# EAGLE design eib-64-nanoz-adapter (EAGLE 9.5.2)
DESIGNER: JPN@MIT; DESIGN_NAME: EIB-64 NanoZ Adapter; LICENSE: CERN OHL v1.2; REVISION: 1.1
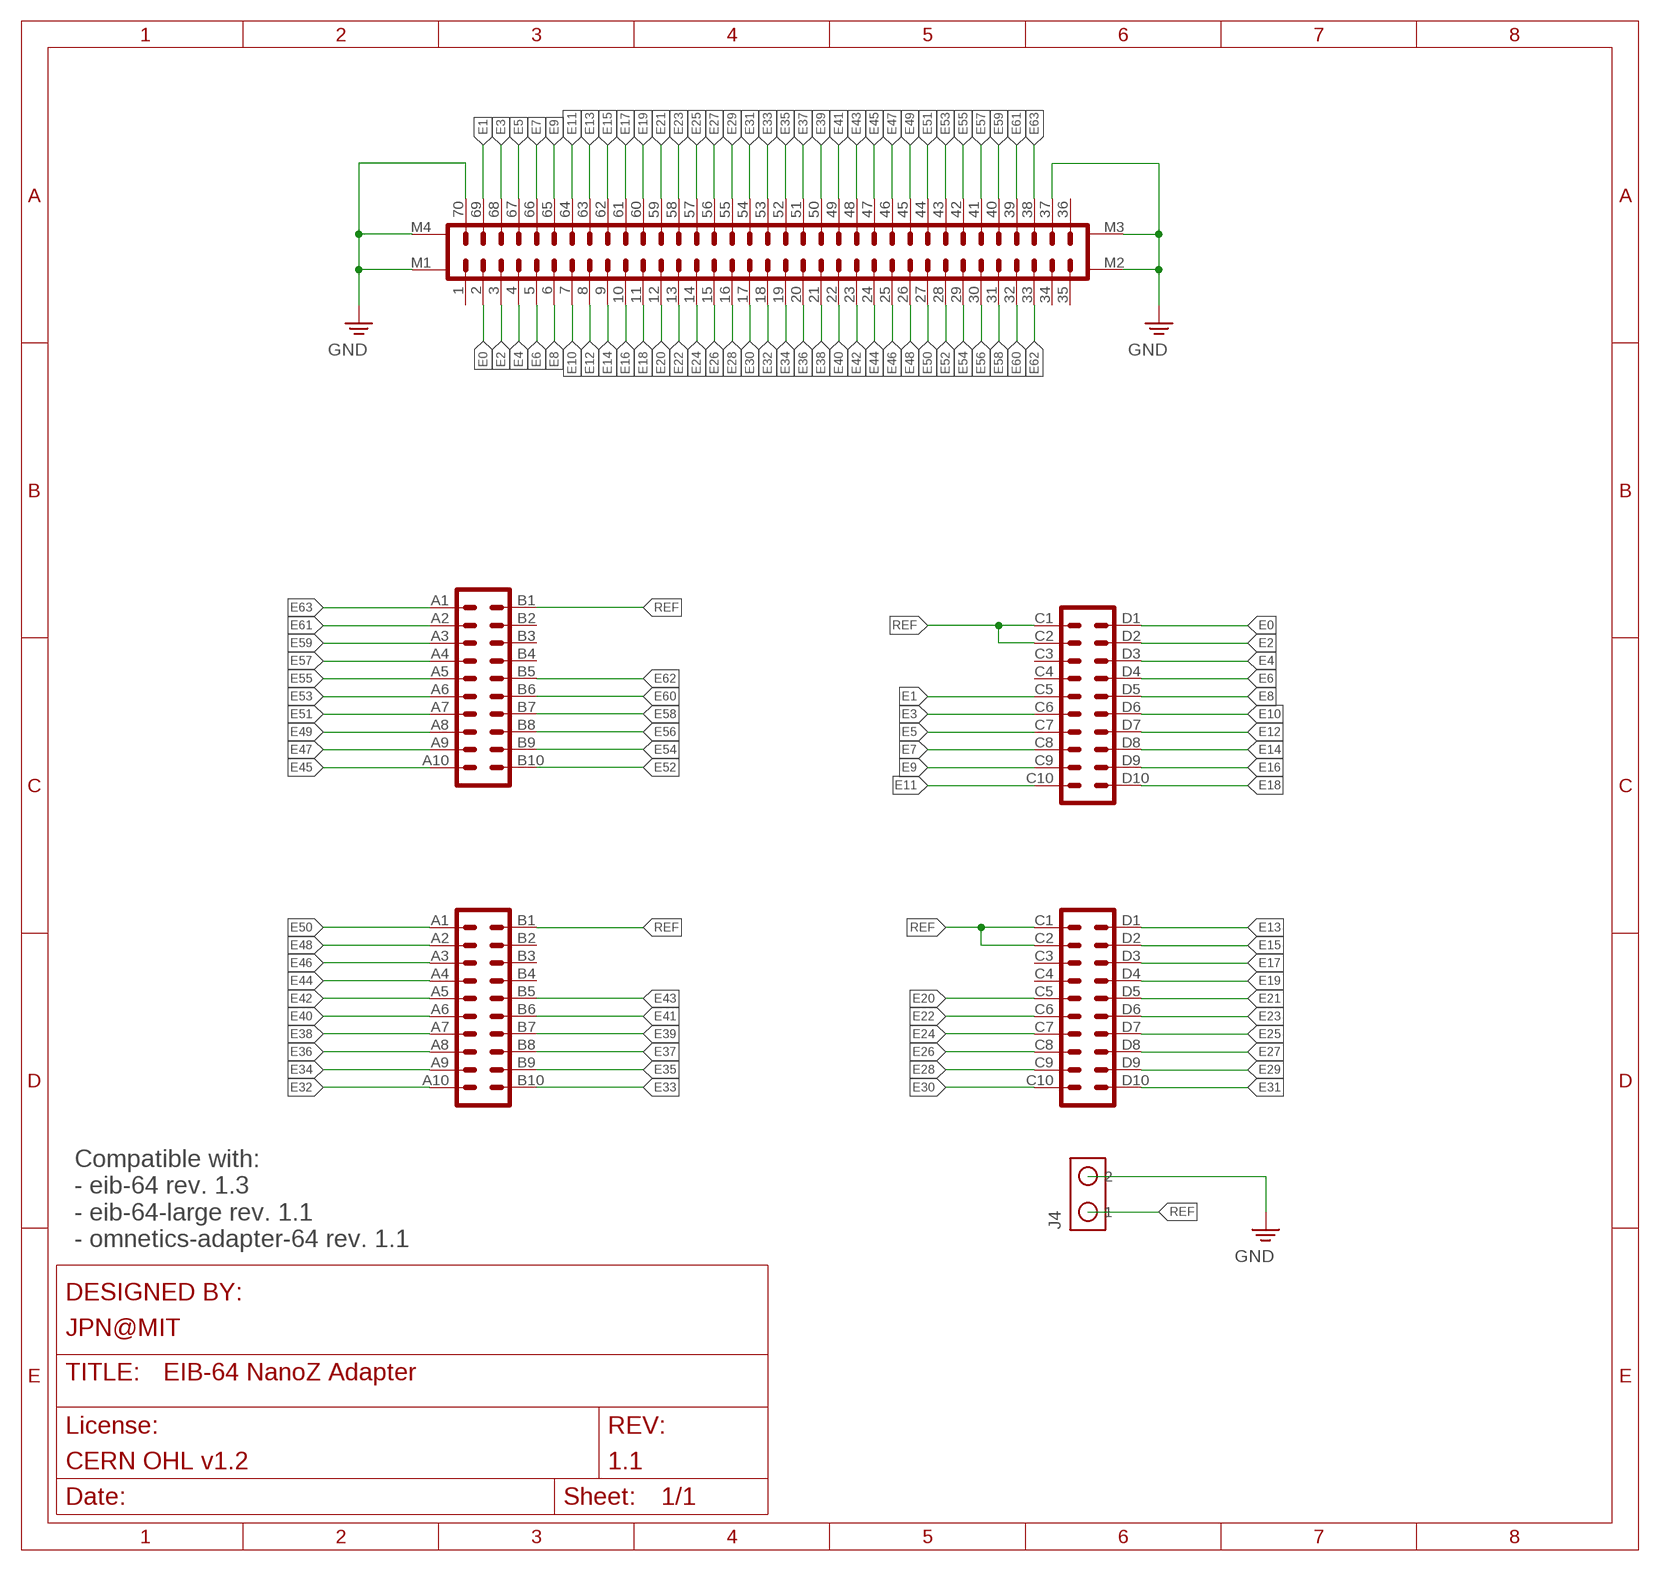
[diagram p0: schematic, sheet 1]

## Parts
J1  DF40-REC  PINHD-2X35+4_DF40-70HEAD  [DF40-70HEAD]
J2  PINHD-4X10_MOLC-THRU  [MOLC-110-11-S-Q]
J3  PINHD-4X10_MOLC-THRU  [MOLC-110-11-S-Q]
J4  SCREW2  [SCREW2]

## Nets
E0: J1.2 J2.D1
E1: J1.69 J2.C5
E2: J1.3 J2.D2
E3: J1.68 J2.C6
E4: J1.4 J2.D3
E5: J1.67 J2.C7
E6: J1.5 J2.D4
E7: J1.66 J2.C8
E8: J1.6 J2.D5
E9: J1.65 J2.C9
E10: J1.7 J2.D6
E11: J1.64 J2.C10
E12: J1.8 J2.D7
E13: J1.63 J3.D1
E14: J1.9 J2.D8
E15: J1.62 J3.D2
E16: J1.10 J2.D9
E17: J1.61 J3.D3
E18: J1.11 J2.D10
E19: J1.60 J3.D4
E20: J1.12 J3.C5
E21: J1.59 J3.D5
E22: J1.13 J3.C6
E23: J1.58 J3.D6
E24: J1.14 J3.C7
E25: J1.57 J3.D7
E26: J1.15 J3.C8
E27: J1.56 J3.D8
E28: J1.16 J3.C9
E29: J1.55 J3.D9
E30: J1.17 J3.C10
E31: J1.54 J3.D10
E32: J1.18 J3.A10
E33: J1.53 J3.B10
E34: J1.19 J3.A9
E35: J1.52 J3.B9
E36: J1.20 J3.A8
E37: J1.51 J3.B8
E38: J1.21 J3.A7
E39: J1.50 J3.B7
E40: J1.22 J3.A6
E41: J1.49 J3.B6
E42: J1.23 J3.A5
E43: J1.48 J3.B5
E44: J1.24 J3.A4
E45: J1.47 J2.A10
E46: J1.25 J3.A3
E47: J1.46 J2.A9
E48: J1.26 J3.A2
E49: J1.45 J2.A8
E50: J1.27 J3.A1
E51: J1.44 J2.A7
E52: J1.28 J2.B10
E53: J1.43 J2.A6
E54: J1.29 J2.B9
E55: J1.42 J2.A5
E56: J1.30 J2.B8
E57: J1.41 J2.A4
E58: J1.31 J2.B7
E59: J1.40 J2.A3
E60: J1.32 J2.B6
E61: J1.39 J2.A2
E62: J1.33 J2.B5
E63: J1.38 J2.A1
GND: J1.37 J1.70 J1.M1 J1.M2 J1.M3 J1.M4 J4.P$2
REF: J2.B1 J2.C1 J2.C2 J3.B1 J3.C1 J3.C2 J4.P$1
Unconnected: J1.1 J1.34 J1.35 J1.36 J2.B2 J2.B3 J2.B4 J2.C3 J2.C4 J3.B2 J3.B3 J3.B4 J3.C3 J3.C4

## Notes on the sheet
- Compatible with:
  - eib-64 rev. 1.3
  - eib-64-large rev. 1.1
  - omnetics-adapter-64 rev. 1.1

## Library data of the parts
J1 = jonnew:PINHD-2X35+4
J2 J3 = jonnew:PINHD-4X10
J4 = jonnew:SCREW2: Screw Terminal

## Net classes
1 thick: width 0.102 mm

## Board
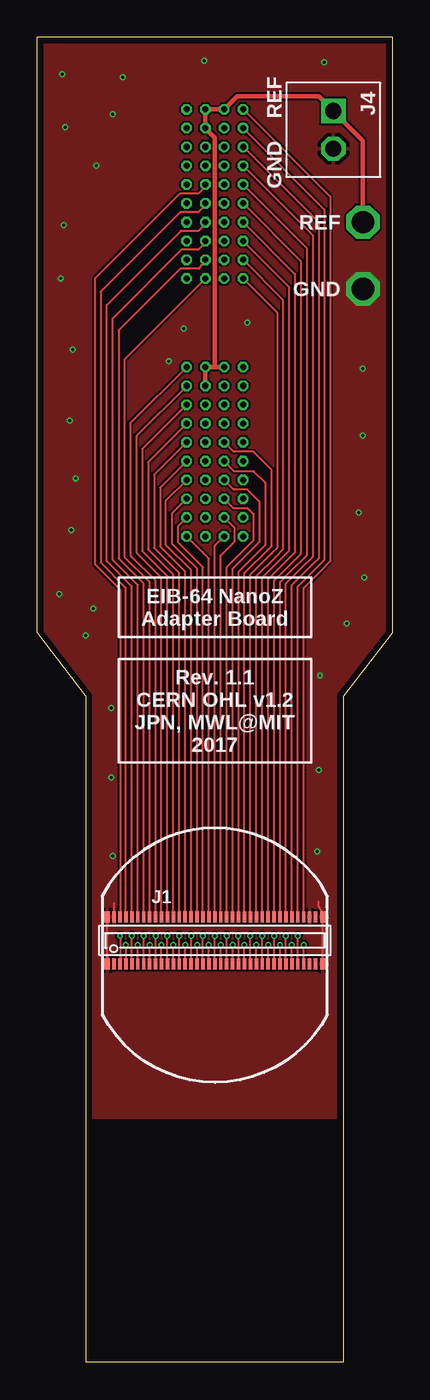
[diagram p1: board, top side]
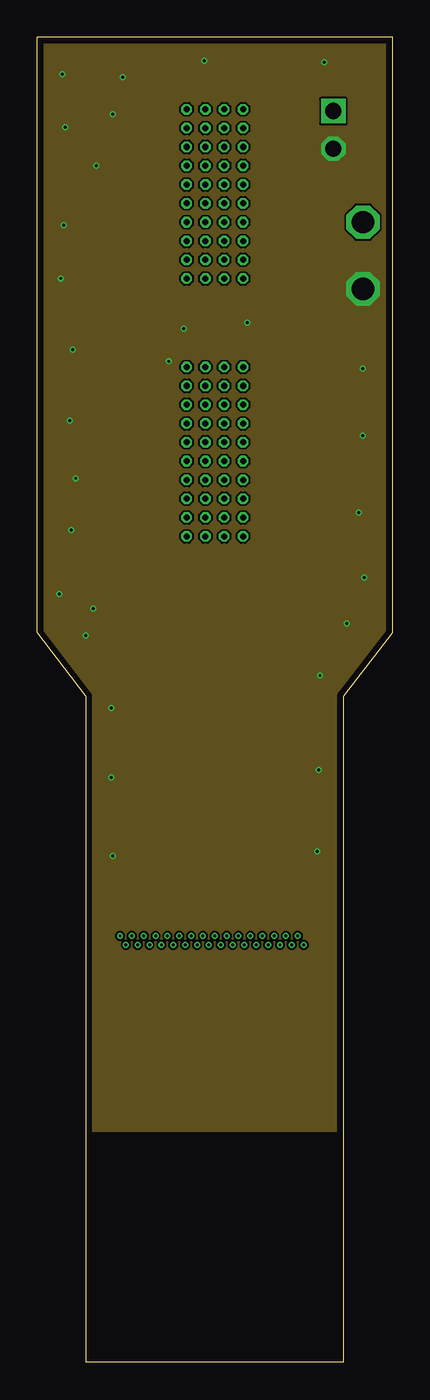
[diagram p2: board, inner layer Route2]
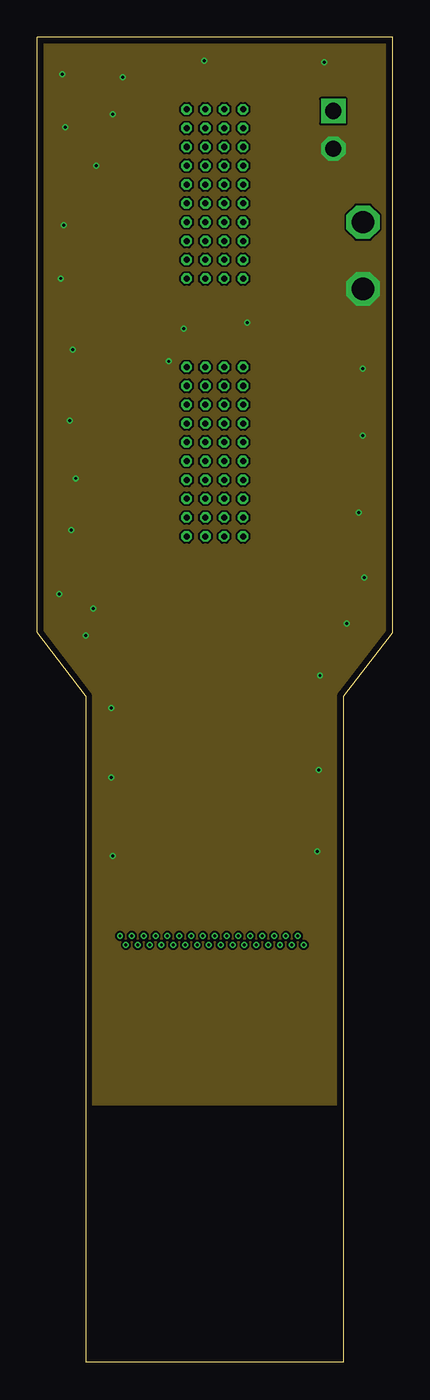
[diagram p3: board, inner layer Route15]
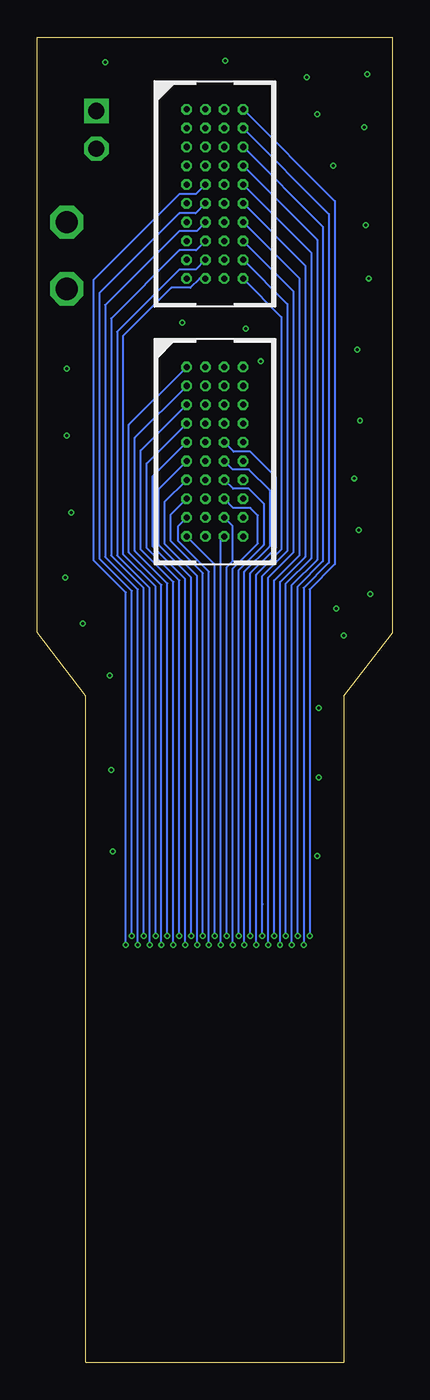
[diagram p4: board, bottom side, seen from below]

Size 24 x 89.5 mm. Coordinates in mm from the lower left corner, seen from the top.
Outline: 20.7,0 20.7,45 24,49.3 24,89.5 0,89.5 0,49.3 3.3,45 3.3,0 20.7,0
Copper layers (1*2*15*16): Top 0.035mm / dielectric 0.2mm / Route2 0.0175mm / dielectric 0.3mm / Route15 0.0175mm / dielectric 0.2mm / Bottom 0.035mm
Design rules "seeed-studio-4-layer *": minimum track width 5mil, minimum drill 0.2mm, track to track 5mil, track to pad 5mil, pad to pad 5mil, via to via 5mil, smd to smd 0mil, copper to edge 0.4mm, drill to drill 10mil, minimum pad ring 6mil, minimum via ring 4mil, stop-mask expansion 4mil, vias tented up to drill 100mil, thermal gap 10mil

### Footprints (pad centres in the part's own frame; a part is rotated, then mirrored left to right if it is on the bottom)
DF40-70HEAD = smd 0.23 x 0.75: 1 -6.8,-1.585; 2 -6.4,-1.585; 3 -6,-1.585; 4 -5.6,-1.585; 5 -5.2,-1.585; 6 -4.8,-1.585; 7 -4.4,-1.585; 8 -4,-1.585; 9 -3.6,-1.585; 10 -3.2,-1.585; 11 -2.8,-1.585; 12 -2.4,-1.585; 13 -2,-1.585; 14 -1.6,-1.585; 15 -1.2,-1.585; 16 -0.8,-1.585; 17 -0.4,-1.585; 18 0,-1.585; 19 0.4,-1.585; 20 0.8,-1.585; 21 1.2,-1.585; 22 1.6,-1.585; 23 2,-1.585; 24 2.4,-1.585; 25 2.8,-1.585; 26 3.2,-1.585; 27 3.6,-1.585; 28 4,-1.585; 29 4.4,-1.585; 30 4.8,-1.585; 31 5.2,-1.585; 32 5.6,-1.585; 33 6,-1.585; 34 6.4,-1.585; 35 6.8,-1.585; 36 6.8,1.585; 37 6.4,1.585; 38 6,1.585; 39 5.6,1.585; 40 5.2,1.585; 41 4.8,1.585; 42 4.4,1.585; 43 4,1.585; 44 3.6,1.585; 45 3.2,1.585; 46 2.8,1.585; 47 2.4,1.585; 48 2,1.585; 49 1.6,1.585; 50 1.2,1.585; 51 0.8,1.585; 52 0.4,1.585; 53 0,1.585; 54 -0.4,1.585; 55 -0.8,1.585; 56 -1.2,1.585; 57 -1.6,1.585; 58 -2,1.585; 59 -2.4,1.585; 60 -2.8,1.585; 61 -3.2,1.585; 62 -3.6,1.585; 63 -4,1.585; 64 -4.4,1.585; 65 -4.8,1.585; 66 -5.2,1.585; 67 -5.6,1.585; 68 -6,1.585; 69 -6.4,1.585; 70 -6.8,1.585 | smd 0.35 x 0.75: M1 -7.275,-1.585; M2 7.275,-1.585; M3 7.275,1.585; M4 -7.275,1.585
MOLC-110-11-S-Q = drill 0.406 octagon: A1 -1.905,5.715; A2 -1.905,4.445; A3 -1.905,3.175; A4 -1.905,1.905; A5 -1.905,0.635; A6 -1.905,-0.635; A7 -1.905,-1.905; A8 -1.905,-3.175; A9 -1.905,-4.445; A10 -1.905,-5.715; B1 -0.635,5.715; B2 -0.635,4.445; B3 -0.635,3.175; B4 -0.635,1.905; B5 -0.635,0.635; B6 -0.635,-0.635; B7 -0.635,-1.905; B8 -0.635,-3.175; B9 -0.635,-4.445; B10 -0.635,-5.715; C1 0.635,5.715; C2 0.635,4.445; C3 0.635,3.175; C4 0.635,1.905; C5 0.635,0.635; C6 0.635,-0.635; C7 0.635,-1.905; C8 0.635,-3.175; C9 0.635,-4.445; C10 0.635,-5.715; D1 1.905,5.715; D2 1.905,4.445; D3 1.905,3.175; D4 1.905,1.905; D5 1.905,0.635; D6 1.905,-0.635; D7 1.905,-1.905; D8 1.905,-3.175; D9 1.905,-4.445; D10 1.905,-5.715
SCREW2 = drill 1.1 square: P$1 0,0 | drill 1.1 octagon: P$2 2.54,0

### Placement (x,y rotation side)
J1  12,28.5 0 top
J2  12,78.9 0 bottom
J3  12,61.5 0 bottom
J4  20,84.5 270 top

### Tracks (layer width: path | path; a pad name or v marks a point on that pad's centre or on a via)
E0  (via drill 0.2)
  Top 0.127: v5.6,28.8 J1.2
  Bottom 0.127: J2.D1 3.9,78.42 3.9,53.9 5.6,52.2 v5.6,28.8
E1
  Top 0.127: J2.C5 11.49,79.54 10.89,78.94 9.64,78.94 3.9,73.2 3.9,53.9 5.6,52.2 J1.69
E2  (via drill 0.2)
  Top 0.127: v6,28.2 J1.3
  Bottom 0.127: J2.D2 4.3,77.55 4.3,54 6,52.3 v6,28.2
E3
  Top 0.127: J2.C6 11.49,78.27 10.89,77.67 9.67,77.67 4.3,72.3 4.3,54 6,52.3 J1.68
E4  (via drill 0.2)
  Top 0.127: J1.4 v6.4,28.8
  Bottom 0.127: J2.D3 4.7,76.68 4.7,54.1 6.4,52.4 v6.4,28.8
E5
  Top 0.127: J2.C7 11.49,77 10.89,76.4 9.7,76.4 4.7,71.4 4.7,54.1 | 4.7,54.1 6.4,52.4 | J1.67 6.4,52.4 | 6.4,52.4 4.7,54.1
E6  (via drill 0.2)
  Top 0.127: J1.5 v6.8,28.2
  Bottom 0.127: J2.D4 5.1,75.81 5.1,54.2 6.8,52.5 v6.8,28.2
E7
  Top 0.127: J2.C8 11.49,75.73 10.89,75.13 9.73,75.13 5.1,70.5 5.1,54.2 | 5.1,54.2 6.8,52.5 | J1.66 6.8,52.5 | 6.8,52.5 5.1,54.2
E8  (via drill 0.2)
  Top 0.127: J1.6 v7.2,28.8
  Bottom 0.127: J2.D5 5.5,74.94 5.5,54.3 7.2,52.6 v7.2,28.8
E9
  Top 0.127: J2.C9 10.93,73.86 9.66,73.86 5.5,69.7 5.5,54.3 7.2,52.6 J1.65
E10  (via drill 0.2)
  Top 0.127: J1.7 v7.6,28.2
  Bottom 0.127: J2.D6 5.9,74.07 5.9,54.4 7.6,52.7 v7.6,28.2
E11
  Top 0.127: J2.C10 5.9,67.72 5.9,54.4 7.6,52.7 J1.64
E12  (via drill 0.2)
  Top 0.127: J1.8 v8,28.8
  Bottom 0.127: J2.D7 6.3,73.2 6.3,54.5 8,52.8 v8,28.8
E13
  Top 0.127: J3.D1 6.3,63.42 6.3,54.5 8,52.8 J1.63
E14  (via drill 0.2)
  Top 0.127: J1.9 v8.4,28.2
  Bottom 0.127: J2.D8 6.7,72.33 6.7,54.7 8.4,53 v8.4,28.2
E15
  Top 0.127: J3.D2 6.7,62.55 6.7,54.7 8.4,53 J1.62
E16  (via drill 0.2)
  Top 0.127: J1.10 v8.8,28.8
  Bottom 0.127: 8.8,31 8.8,53.1 7.1,54.8 7.1,71.46 J2.D9 | 8.8,31 8.8,30.9 | v8.8,28.8 8.8,31
E17
  Top 0.127: J3.D3 7.1,61.68 7.1,54.8 7.7,54.2 | 7.7,54.2 8.8,53.1 | J1.61 8.8,53.1 | 8.8,53.1 7.7,54.2
E18  (via drill 0.2)
  Top 0.127: J1.11 v9.2,28.2
  Bottom 0.127: J2.D10 7.5,70.59 7.5,54.9 9.2,53.2 v9.2,28.2
E19
  Top 0.127: J3.D4 7.5,60.81 7.5,54.9 7.95,54.45 | 7.95,54.45 9.2,53.2 | J1.60 9.2,53.2 | 9.2,53.2 7.95,54.45
E20  (via drill 0.2)
  Top 0.127: J1.12 v9.6,28.8
  Bottom 0.127: J3.C5 10.73,61.5 9.6,61.5 7.9,59.8 7.9,55 9.6,53.3 v9.6,28.8
E21
  Top 0.127: J3.D5 7.9,59.94 7.9,55 8.2,54.7 | 8.2,54.7 9.6,53.3 | J1.59 9.6,53.3 | 9.6,53.3 8.2,54.7
E22  (via drill 0.2)
  Top 0.127: J1.13 v10,28.2
  Bottom 0.127: J3.C6 10.8,60.3 9.7,60.3 8.3,58.9 8.3,55.1 10,53.4 v10,28.2
E23
  Top 0.127: J3.D6 8.3,59.07 8.3,55.1 8.95,54.45 | 8.95,54.45 10,53.4 | J1.58 10,53.4 | 10,53.4 8.95,54.45
E24  (via drill 0.2)
  Top 0.127: J1.14 v10.4,28.8
  Bottom 0.127: J3.C7 10.77,59 9.7,59 8.7,58 8.7,55.2 10.4,53.5 v10.4,28.8
E25
  Top 0.127: J3.D7 8.7,58.2 8.7,55.2 | 8.7,55.2 10.4,53.5 | J1.57 10.4,53.5 | 10.4,53.5 8.7,55.2
E26  (via drill 0.2)
  Top 0.127: J1.15 v10.8,28.2
  Bottom 0.127: J3.C8 10.74,57.7 9.6,57.7 9.1,57.2 9.1,55.3 10.8,53.6 v10.8,28.2
E27
  Top 0.127: J3.D8 9.1,57.33 9.1,55.3 9.95,54.45 | 9.95,54.45 10.8,53.6 | J1.56 10.8,53.6 | 10.8,53.6 9.95,54.45
E28  (via drill 0.2)
  Top 0.127: J1.16 v11.2,28.8
  Bottom 0.127: J3.C9 10.8,56.49 10.8,54.1 11.2,53.7 v11.2,28.8
E29
  Top 0.127: J3.D9 9.5,56.46 9.5,55.4 10.2,54.7 | 10.2,54.7 11.2,53.7 | J1.55 11.2,53.7 | 11.2,53.7 10.2,54.7
E30  (via drill 0.2)
  Top 0.127: J1.17 v11.6,28.2
  Bottom 0.127: J3.C10 11.6,55.55 v11.6,28.2
E31
  Top 0.127: 11.19,54.69 J3.D10 | 11.19,54.69 11.6,54.28 | J1.54 11.6,54.28 | 11.6,54.28 11.19,54.69
E32  (via drill 0.2)
  Top 0.127: J1.18 v12,28.8
  Bottom 0.127: J3.A10 12,53.88 v12,28.8
E33
  Top 0.127: 12,55.15 J3.B10 12,55.15 | J1.53 12,55.15
E34  (via drill 0.2)
  Top 0.127: J1.19 v12.4,28.2
  Bottom 0.127: J3.A9 14.5,56.46 14.5,55.5 12.4,53.4 v12.4,28.2
E35
  Top 0.127: J3.B9 13.3,56.39 13.3,55.4 13.2,55.3 | 13.2,55.3 12.4,54.5 | J1.52 12.4,54.5 | 12.4,54.5 13.2,55.3
E36  (via drill 0.2)
  Top 0.127: J1.20 v12.8,28.8
  Bottom 0.127: J3.A8 15,57.23 15,55.5 12.8,53.3 v12.8,28.8
E37
  Top 0.127: J3.B8 13.26,57.7 14.2,57.7 14.6,57.3 14.6,55.5 13.8,54.7 | 13.8,54.7 12.8,53.7 | J1.51 12.8,53.7 | 12.8,53.7 13.8,54.7
E38  (via drill 0.2)
  Top 0.127: J1.21 v13.2,28.2
  Bottom 0.127: J3.A7 15.4,58.1 15.4,55.3 13.2,53.1 v13.2,28.2
E39
  Top 0.127: J3.B7 13.29,58.94 14.2,58.94 15,58.13 15,55.4 14.55,54.95 | 14.55,54.95 13.2,53.6 | J1.50 13.2,53.6 | 13.2,53.6 14.55,54.95
E40  (via drill 0.2)
  Top 0.127: J1.22 v13.6,28.79 v13.59,28.8
  Bottom 0.127: J3.A6 15.8,58.97 15.8,55.2 13.6,53 13.6,30.9 13.59,30.89 v13.59,28.8
E41
  Top 0.127: J3.B6 13.29,60.2 13.3,60.2 14.6,60.2 15.4,59.4 15.4,55.2 14.85,54.65 | 14.85,54.65 13.6,53.4 | J1.49 13.6,53.4 | 13.6,53.4 14.85,54.65
E42  (via drill 0.2)
  Top 0.127: J1.23 v14,28.2
  Bottom 0.127: J3.A5 16.2,59.84 16.2,55.1 14,52.9 v14,28.2
E43
  Top 0.127: J3.B5 | J3.B5 13.27,61.5 14.6,61.5 15.8,60.3 15.8,55.1 15.6,54.9 | 15.6,54.9 14,53.3 | J1.48 14,53.3 | 14,53.3 15.6,54.9
E44  (via drill 0.2)
  Top 0.127: J1.24 v14.4,28.8
  Bottom 0.127: J3.A4 16.6,60.71 16.6,55 14.4,52.8 v14.4,28.8
E45
  Top 0.127: J2.A10 16.2,70.89 16.2,55 15.85,54.65 | 15.85,54.65 14.4,53.2 | J1.47 14.4,53.2 | 14.4,53.2 15.85,54.65
E46  (via drill 0.2)
  Top 0.127: J1.25 v14.8,28.2
  Bottom 0.127: J3.A3 17,61.58 17,54.9 14.8,52.7 v14.8,28.2
E47
  Top 0.127: J2.A9 16.6,71.76 16.6,54.9 16.1,54.4 | 16.1,54.4 14.8,53.1 | J1.46 14.8,53.1 | 14.8,53.1 16.1,54.4
E48  (via drill 0.2)
  Top 0.127: J1.26 v15.2,28.8
  Bottom 0.127: J3.A2 17.4,62.45 17.4,54.8 15.2,52.6 v15.2,28.8
E49
  Top 0.127: J2.A8 17,72.63 17,54.8 16.35,54.15 | 16.35,54.15 15.2,53 | J1.45 15.2,53 | 15.2,53 16.35,54.15
E50  (via drill 0.2)
  Top 0.127: J1.27 v15.6,28.2
  Bottom 0.127: J3.A1 17.8,63.32 17.8,54.7 15.6,52.5 v15.6,28.2
E51
  Top 0.127: J2.A7 17.4,73.5 17.4,54.7 17.1,54.4 | 17.1,54.4 15.6,52.9 | J1.44 15.6,52.9 | 15.6,52.9 17.1,54.4
E52  (via drill 0.2)
  Top 0.127: J1.28 v16,28.8
  Bottom 0.127: J2.B10 13.03,73.19 13.65,72.57 14.93,72.57 18.2,69.3 18.2,54.6 16,52.4 v16,28.8
E53
  Top 0.127: J2.A6 17.8,74.37 17.8,54.6 17.35,54.15 | 17.35,54.15 16,52.8 | J1.43 16,52.8 | 16,52.8 17.35,54.15
E54  (via drill 0.2)
  Top 0.127: J1.29 v16.4,28.2
  Bottom 0.127: J2.B9 13.3,73.8 14.4,73.8 18.6,69.6 18.6,54.5 16.4,52.3 v16.4,28.2
E55
  Top 0.127: J2.A5 18.2,75.24 18.2,54.5 17.1,53.4 | 17.1,53.4 16.4,52.7 | J1.42 16.4,52.7 | 16.4,52.7 17.1,53.4
E56  (via drill 0.2)
  Top 0.127: J1.30 v16.8,28.8
  Bottom 0.127: J2.B8 13.26,75.1 14.4,75.1 19,70.5 19,54.5 16.8,52.3 v16.8,28.8
E57
  Top 0.127: J2.A4 18.6,76.11 18.6,54.4 17.85,53.65 | 17.85,53.65 16.8,52.6 | J1.41 16.8,52.6 | 16.8,52.6 17.85,53.65
E58  (via drill 0.2)
  Top 0.127: J1.31 v17.2,28.2
  Bottom 0.127: J2.B7 13.23,76.4 14.4,76.4 19.4,71.4 19.4,54.4 17.2,52.2 v17.2,28.2
E59
  Top 0.127: J2.A3 19,76.98 19,54.3 18.6,53.9 | 18.6,53.9 17.2,52.5 | J1.40 17.2,52.5 | 17.2,52.5 18.6,53.9
E60  (via drill 0.2)
  Top 0.127: J1.32 v17.6,28.8
  Bottom 0.127: J2.B6 13.3,77.6 14.4,77.6 19.8,72.2 19.8,54.3 17.6,52.1 v17.6,28.8
E61
  Top 0.127: J2.A2 19.4,77.85 19.4,54.2 18.85,53.65 | 18.85,53.65 17.6,52.4 | J1.39 17.6,52.4 | 17.6,52.4 18.85,53.65
E62  (via drill 0.2)
  Top 0.127: J1.33 v18,28.2
  Bottom 0.127: J2.B5 13.27,78.9 14.4,78.9 20.2,73.1 20.2,54.2 18,52 v18,28.2
E63
  Top 0.127: J2.A1 19.8,78.72 19.8,54.1 19.1,53.4 | 19.1,53.4 18,52.3 | J1.38 18,52.3 | 18,52.3 19.1,53.4
GND  (via drill 0.2, 1.5)
  Top 0.127: J1.M1 J1.M4 | J1.M2 J1.M3 19.27,30.32 19,30.8 19,31.1 | J1.70 5.2,31
  other vias: 22,72.5 20.9,49.9 22.1,53 21.7,57.4 22,62.6 22,67.1 2.2,63.6 2.3,56.2 3.3,49.1 3.8,50.9 1.6,73.2 4,80.8 1.7,87 11.3,87.9 5.8,86.8 19.4,87.8 14.2,70.2 9.9,69.8 8.9,67.6 1.5,51.9 2.6,59.7 2.4,68.4 1.8,76.8 1.9,83.4 5.1,84.3 5.1,34.2 18.9,34.5 19,40 19.1,46.4 5,44.2 5,39.5
  pour Top (rank 3): -4,93.5 26,93.5 26,16.5 -4,16.5
  pour Route2 (rank 3, no thermals): -2.7,92.6 27.3,92.6 27.3,15.6 -2.7,15.6
  pour Route15 (rank 3, no thermals): -5.4,94.4 24.6,94.4 24.6,17.4 -5.4,17.4
REF  (via drill 1.5)
  Top 0.305: 12,67.22 12,82.71 J2.C2 J2.C1 J2.B1 13.52,85.5 19,85.5 J4.P$1 22,82.5 v22,77 | J3.B1 12,67.22 | 12,67.22 J3.C1 J3.C2

### Text on the board
tPlace: REF | GND | REF | GND | EIB-64 NanoZ / Adapter Board | Rev. 1.1 / CERN OHL v1.2 / JPN, MWL@MIT / 2017